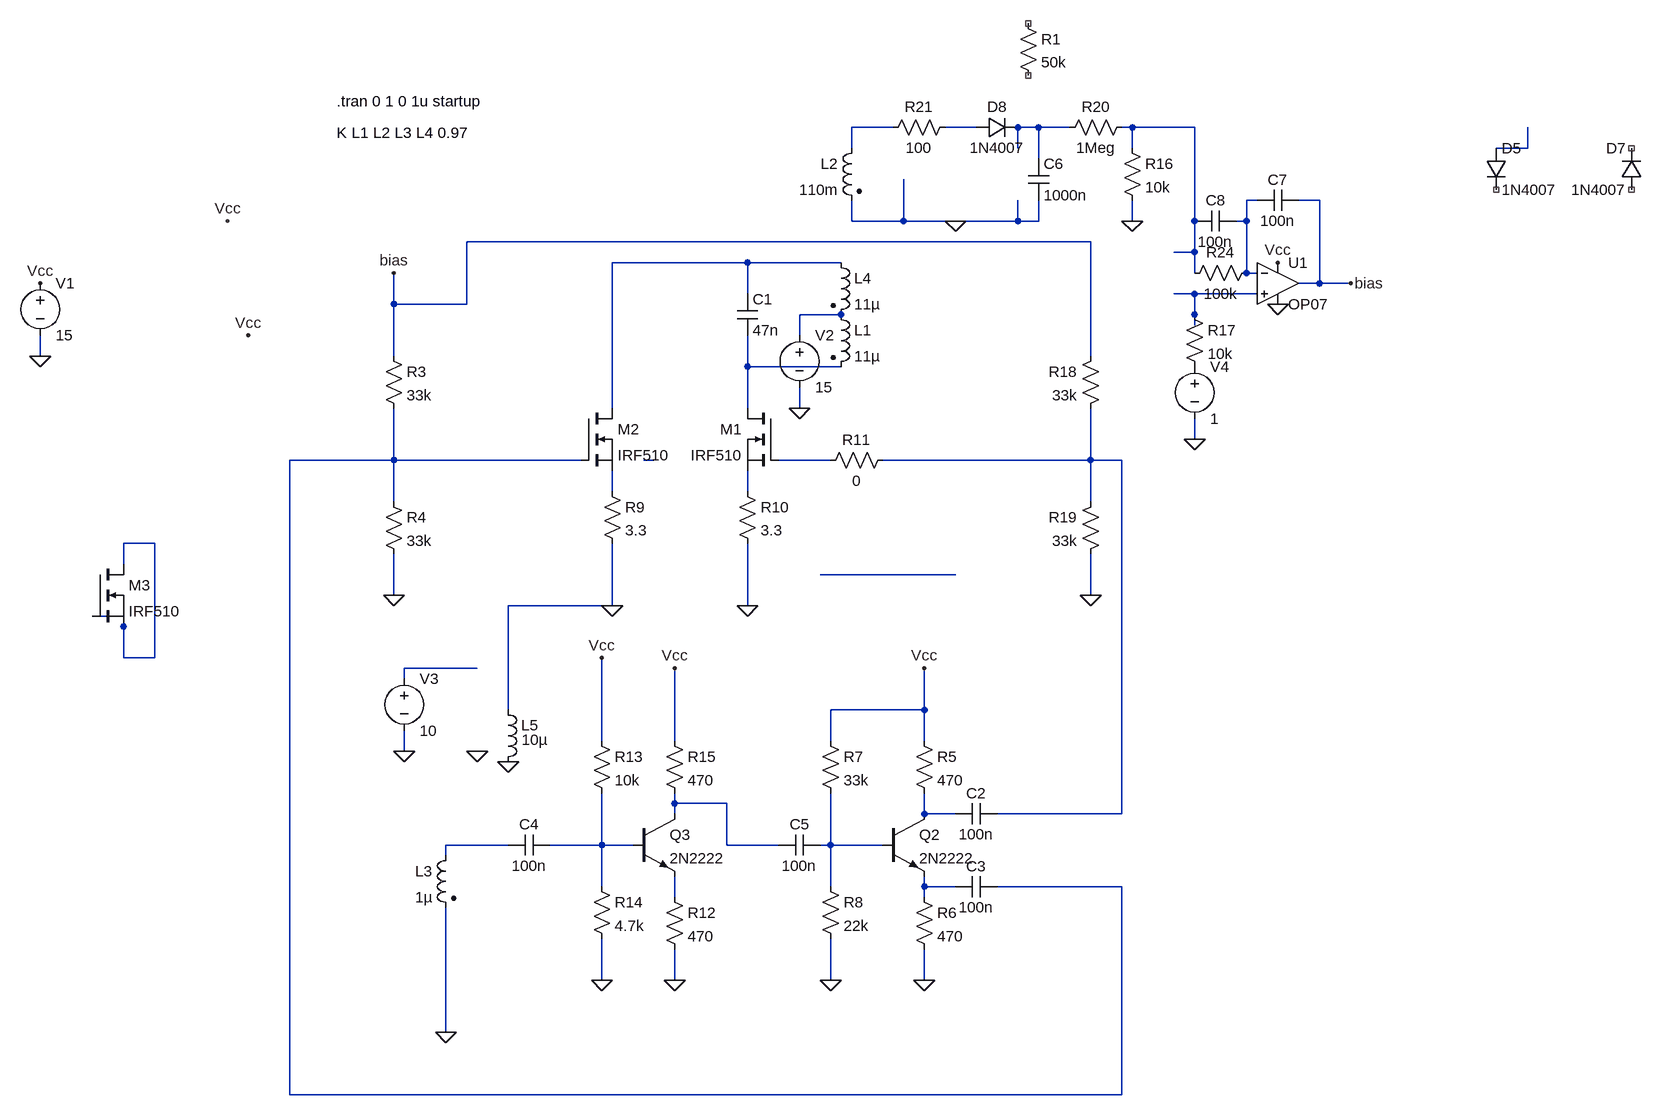
[diagram p0: schematic royer7_mosfet_no_buffer.asc]
royer7_mosfet_no_buffer.asc, the LTspice schematic file:
Version 4
SHEET 1 2216 1780
WIRE 464 48 400 48
WIRE 592 48 544 48
WIRE 688 48 656 48
WIRE 736 48 688 48
WIRE 832 48 816 48
WIRE 928 48 832 48
WIRE 400 80 400 48
WIRE 656 80 656 48
WIRE 832 80 832 48
WIRE 1440 80 1440 48
WIRE 1440 80 1392 80
WIRE 688 96 688 48
WIRE 1024 160 1008 160
WIRE 1120 160 1088 160
WIRE 400 192 400 160
WIRE 480 192 480 128
WIRE 480 192 400 192
WIRE 560 192 480 192
WIRE 656 192 656 160
WIRE 656 192 560 192
WIRE 688 192 688 160
WIRE 688 192 656 192
WIRE 832 192 832 160
WIRE 928 192 928 48
WIRE 1008 192 1008 160
WIRE 1008 192 992 192
WIRE 768 224 -192 224
WIRE 928 240 928 192
WIRE 928 240 896 240
WIRE 240 256 32 256
WIRE 384 256 240 256
WIRE 928 272 928 240
WIRE 1008 272 1008 192
WIRE 1024 272 1008 272
WIRE 1120 288 1120 160
WIRE 1120 288 1088 288
WIRE 1168 288 1120 288
WIRE 240 304 240 256
WIRE 928 304 896 304
WIRE 1024 304 928 304
WIRE -304 320 -304 272
WIRE -192 320 -192 224
WIRE -192 320 -304 320
WIRE 384 336 320 336
WIRE 928 336 928 304
WIRE 928 352 928 336
WIRE 320 368 320 336
WIRE -848 400 -848 368
WIRE -304 400 -304 320
WIRE 768 400 768 224
WIRE 240 416 240 368
WIRE 384 416 240 416
WIRE 32 480 32 256
WIRE 240 480 240 416
WIRE 320 480 320 448
WIRE 928 528 928 496
WIRE -304 560 -304 480
WIRE -304 560 -464 560
WIRE -16 560 -304 560
WIRE 96 560 80 560
WIRE 368 560 288 560
WIRE 768 560 768 480
WIRE 768 560 448 560
WIRE 816 560 768 560
WIRE 32 608 32 576
WIRE 240 608 240 576
WIRE -304 624 -304 560
WIRE 768 624 768 560
WIRE -672 688 -720 688
WIRE -720 720 -720 688
WIRE 560 736 352 736
WIRE -304 768 -304 704
WIRE 768 768 768 704
WIRE 32 784 32 688
WIRE 32 784 -128 784
WIRE 240 784 240 688
WIRE -720 800 -768 800
WIRE -720 816 -720 800
WIRE -720 864 -720 816
WIRE -672 864 -672 688
WIRE -672 864 -720 864
WIRE -176 880 -288 880
WIRE -288 896 -288 880
WIRE -128 944 -128 784
WIRE 512 944 512 880
WIRE 512 944 368 944
WIRE 16 992 16 864
WIRE 128 992 128 880
WIRE 368 992 368 944
WIRE 512 992 512 944
WIRE -288 1008 -288 976
WIRE 128 1088 128 1072
WIRE 208 1088 128 1088
WIRE 128 1104 128 1088
WIRE 512 1104 512 1072
WIRE 560 1104 512 1104
WIRE 816 1104 816 560
WIRE 816 1104 624 1104
WIRE -128 1152 -224 1152
WIRE 16 1152 16 1072
WIRE 16 1152 -64 1152
WIRE 64 1152 16 1152
WIRE 208 1152 208 1088
WIRE 288 1152 208 1152
WIRE 368 1152 368 1072
WIRE 368 1152 352 1152
WIRE 448 1152 368 1152
WIRE -224 1168 -224 1152
WIRE 16 1216 16 1152
WIRE 368 1216 368 1152
WIRE 512 1216 512 1200
WIRE 560 1216 512 1216
WIRE 816 1216 624 1216
WIRE 128 1232 128 1200
WIRE 512 1232 512 1216
WIRE 16 1360 16 1296
WIRE 128 1360 128 1312
WIRE 368 1360 368 1296
WIRE 512 1360 512 1312
WIRE -224 1440 -224 1248
WIRE -464 1536 -464 560
WIRE 816 1536 816 1216
WIRE 816 1536 -464 1536
FLAG -848 400 0
FLAG -848 288 Vcc
FLAG 368 1360 0
FLAG 512 880 Vcc
FLAG -176 1008 0
FLAG 768 768 0
FLAG -304 768 0
FLAG -128 1024 0
FLAG 320 480 0
FLAG 128 880 Vcc
FLAG 128 1360 0
FLAG 16 1360 0
FLAG 16 864 Vcc
FLAG -224 1440 0
FLAG -288 1008 0
FLAG -304 272 bias
FLAG -528 368 Vcc
FLAG -560 192 Vcc
FLAG 512 1360 0
FLAG 560 192 0
FLAG 1056 256 Vcc
FLAG 1056 320 0
FLAG 1168 288 bias
FLAG 832 192 0
FLAG 928 528 0
FLAG 240 784 0
FLAG 32 784 0
SYMBOL voltage -848 272 R0
WINDOW 123 0 0 Left 0
WINDOW 39 0 0 Left 0
SYMATTR InstName V1
SYMATTR Value 15
SYMBOL ind2 368 320 R0
SYMATTR InstName L1
SYMATTR Value 11µ
SYMATTR Type ind
SYMBOL ind2 416 64 M0
SYMATTR InstName L2
SYMATTR Value 110m
SYMATTR Type ind
SYMATTR SpiceLine Rser=5
SYMBOL ind2 -208 1152 M0
SYMATTR InstName L3
SYMATTR Value 1µ
SYMATTR Type ind
SYMATTR SpiceLine Rser=0.1
SYMBOL ind2 368 240 R0
SYMATTR InstName L4
SYMATTR Value 11µ
SYMATTR Type ind
SYMBOL cap 224 304 R0
SYMATTR InstName C1
SYMATTR Value 47n
SYMBOL npn 448 1104 R0
SYMATTR InstName Q2
SYMATTR Value 2N2222
SYMBOL res 496 976 R0
SYMATTR InstName R5
SYMATTR Value 470
SYMBOL res 496 1216 R0
SYMATTR InstName R6
SYMATTR Value 470
SYMBOL res 352 976 R0
SYMATTR InstName R7
SYMATTR Value 33k
SYMBOL res 352 1200 R0
SYMATTR InstName R8
SYMATTR Value 22k
SYMBOL cap -128 1136 M90
WINDOW 0 0 32 VBottom 2
WINDOW 3 32 32 VTop 2
SYMATTR InstName C4
SYMATTR Value 100n
SYMBOL cap 624 1088 R90
WINDOW 0 0 32 VBottom 2
WINDOW 3 32 32 VTop 2
SYMATTR InstName C2
SYMATTR Value 100n
SYMBOL cap 624 1200 R90
WINDOW 0 0 32 VBottom 2
WINDOW 3 32 32 VTop 2
SYMATTR InstName C3
SYMATTR Value 100n
SYMBOL res 784 384 M0
SYMATTR InstName R18
SYMATTR Value 33k
SYMBOL res 784 608 M0
SYMATTR InstName R19
SYMATTR Value 33k
SYMBOL nmos 288 480 M0
SYMATTR InstName M1
SYMATTR Value IRF510
SYMBOL nmos -16 480 R0
SYMATTR InstName M2
SYMATTR Value IRF510
SYMBOL res -320 384 R0
SYMATTR InstName R3
SYMATTR Value 33k
SYMBOL res -320 608 R0
SYMATTR InstName R4
SYMATTR Value 33k
SYMBOL ind -144 928 R0
WINDOW 3 37 62 Left 2
SYMATTR InstName L5
SYMATTR Value 10µ
SYMBOL res 16 592 R0
SYMATTR InstName R9
SYMATTR Value 3.3
SYMBOL res 224 592 R0
SYMATTR InstName R10
SYMATTR Value 3.3
SYMBOL res 464 544 R90
WINDOW 0 0 56 VBottom 2
WINDOW 3 32 56 VTop 2
SYMATTR InstName R11
SYMATTR Value 0
SYMBOL voltage 320 352 R0
WINDOW 123 0 0 Left 0
WINDOW 39 0 0 Left 0
SYMATTR InstName V2
SYMATTR Value 15
SYMBOL npn 64 1104 R0
SYMATTR InstName Q3
SYMATTR Value 2N2222
SYMBOL res 112 1216 R0
SYMATTR InstName R12
SYMATTR Value 470
SYMBOL res 0 976 R0
SYMATTR InstName R13
SYMATTR Value 10k
SYMBOL res 0 1200 R0
SYMATTR InstName R14
SYMATTR Value 4.7k
SYMBOL cap 288 1136 M90
WINDOW 0 0 32 VBottom 2
WINDOW 3 32 32 VTop 2
SYMATTR InstName C5
SYMATTR Value 100n
SYMBOL res 112 976 R0
SYMATTR InstName R15
SYMATTR Value 470
SYMBOL voltage -288 880 R0
WINDOW 123 0 0 Left 0
WINDOW 39 0 0 Left 0
SYMATTR InstName V3
SYMATTR Value 10
SYMBOL cap 672 96 R0
SYMATTR InstName C6
SYMATTR Value 1000n
SYMBOL diode 1376 80 R0
SYMATTR InstName D5
SYMATTR Value 1N4007
SYMBOL diode 1616 144 R180
WINDOW 0 24 64 Left 2
WINDOW 3 24 0 Left 2
SYMATTR InstName D7
SYMATTR Value 1N4007
SYMBOL diode 592 64 R270
WINDOW 0 32 32 VTop 2
WINDOW 3 0 32 VBottom 2
SYMATTR InstName D8
SYMATTR Value 1N4007
SYMBOL res 560 32 R90
WINDOW 0 0 56 VBottom 2
WINDOW 3 32 56 VTop 2
SYMATTR InstName R21
SYMATTR Value 100
SYMBOL nmos -768 720 R0
SYMATTR InstName M3
SYMATTR Value IRF510
SYMBOL OpAmps\\OP07 1056 224 R0
SYMATTR InstName U1
SYMBOL res 816 64 R0
SYMATTR InstName R16
SYMATTR Value 10k
SYMBOL res 832 32 R90
WINDOW 0 0 56 VBottom 2
WINDOW 3 32 56 VTop 2
SYMATTR InstName R20
SYMATTR Value 1Meg
SYMBOL voltage 928 400 R0
WINDOW 123 0 0 Left 0
WINDOW 39 0 0 Left 0
SYMATTR InstName V4
SYMATTR Value 1
SYMBOL res 1024 256 R90
WINDOW 0 0 56 VBottom 2
WINDOW 3 32 56 VTop 2
SYMATTR InstName R24
SYMATTR Value 100k
SYMBOL cap 1088 144 R90
WINDOW 0 0 32 VBottom 2
WINDOW 3 32 32 VTop 2
SYMATTR InstName C7
SYMATTR Value 100n
SYMBOL res 656 -128 R0
SYMATTR InstName R1
SYMATTR Value 50k
SYMBOL res 912 320 R0
SYMATTR InstName R17
SYMATTR Value 10k
SYMBOL cap 928 208 R270
WINDOW 0 32 32 VTop 2
WINDOW 3 0 32 VBottom 2
SYMATTR InstName C8
SYMATTR Value 100n
TEXT -392 56 Left 2 !K L1 L2 L3 L4 0.97
TEXT -392 8 Left 2 !.tran 0 1 0 1u startup

The netlist it stands for:
* royer7_mosfet_no_buffer.asc
V1 Vcc 0 15
L1 N009 N010 11µ
L2 N001 0 110m Rser=5
L3 N022 0 1µ Rser=0.1
L4 N007 N009 11µ
C1 N007 N010 47n
Q2 N021 N024 N025 0 2N2222
R5 Vcc N021 470
R6 N025 0 470
R7 Vcc N024 33k
R8 N024 0 22k
C4 N022 N023 100n
C2 N014 N021 100n
C3 N011 N025 100n
R18 bias N014 33k
R19 N014 0 33k
M1 N010 N013 N016 N016 IRF510
M2 N007 N011 N015 N015 IRF510
R3 bias N011 33k
R4 N011 0 33k
L5 0 0 10µ
R9 N015 0 3.3
R10 N016 0 3.3
R11 N014 N013 0
V2 N009 0 15
Q3 N020 N023 N026 0 2N2222
R12 N026 0 470
R13 Vcc N023 10k
R14 N023 0 4.7k
C5 N020 N024 100n
R15 Vcc N020 470
V3 N019 0 10
C6 N003 0 1000n
D5 N005 NC_01 1N4007
D7 NC_02 NC_03 1N4007
D8 N002 N003 1N4007
R21 N002 N001 100
M3 N017 N017 N017 N017 IRF510
XU1 N008 N006 Vcc 0 bias LT1001  ; OP07, pins In+ In- V+ V- OUT
R16 N004 0 10k
R20 N004 N003 1Meg
V4 P001 0 1
R24 N006 N004 100k
C7 bias N006 100n
R1 NC_04 NC_05 50k
R17 N008 P001 10k
C8 N004 N006 100n
.model D D
.lib standard.dio
.model NPN NPN
.model PNP PNP
.lib standard.bjt
.model NMOS NMOS
.model PMOS PMOS
.lib standard.mos
K L1 L2 L3 L4 0.97
.tran 0 1 0 1u startup
.lib LTC.lib
.backanno
.end